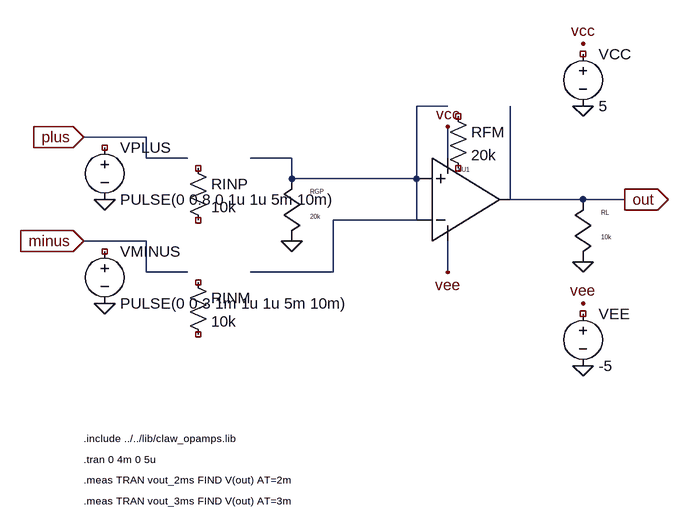
[diagram p0: schematic opamp_difference.asc]
opamp_difference.asc, the LTspice schematic file:
Version 4
SHEET 1 1200 935
WIRE 64 192 160 192
WIRE 160 192 160 224
WIRE 160 224 224 224
WIRE 320 224 384 224
WIRE 384 224 384 256
WIRE 384 256 576 256
WIRE 64 352 160 352
WIRE 160 352 160 400
WIRE 160 400 224 400
WIRE 320 400 448 400
WIRE 448 400 448 320
WIRE 448 320 576 320
WIRE 576 320 576 144
WIRE 576 144 624 144
WIRE 720 144 720 288
WIRE 720 288 896 288
WIRE 624 224 624 176
WIRE 624 352 624 400
SYMBOL voltage 96 192 R0
SYMATTR InstName VPLUS
SYMATTR Value PULSE(0 0.8 0 1u 1u 5m 10m)
SYMBOL voltage 96 352 R0
SYMATTR InstName VMINUS
SYMATTR Value PULSE(0 0.3 1m 1u 1u 5m 10m)
SYMBOL voltage 832 48 R0
SYMATTR InstName VCC
SYMATTR Value 5
SYMBOL voltage 832 448 R0
SYMATTR InstName VEE
SYMATTR Value -5
SYMBOL res 224 400 R0
SYMATTR InstName RINM
SYMATTR Value 10k
SYMBOL res 624 144 R0
SYMATTR InstName RFM
SYMATTR Value 20k
SYMBOL res 224 224 R0
SYMATTR InstName RINP
SYMATTR Value 10k
SYMBOL res_v 384 256 R0
SYMATTR InstName RGP
SYMATTR Value 20k
SYMBOL opamp2 576 224 R0
SYMATTR InstName XU1
SYMATTR Value CLAW_IDEAL_OPAMP
SYMBOL res_v 832 288 R0
SYMATTR InstName RL
SYMATTR Value 10k
FLAG 64 192 plus
IOPIN 64 192 In
FLAG 64 352 minus
IOPIN 64 352 In
FLAG 896 288 out
IOPIN 896 288 Out
FLAG 96 288 0
FLAG 96 448 0
FLAG 384 352 0
FLAG 832 384 0
FLAG 832 48 vcc
FLAG 832 144 0
FLAG 832 448 vee
FLAG 832 544 0
FLAG 624 176 vcc
FLAG 624 400 vee
TEXT 64 656 Left 1 !.include ../../lib/claw_opamps.lib
TEXT 64 688 Left 1 !.tran 0 4m 0 5u
TEXT 64 720 Left 1 !.meas TRAN vout_2ms FIND V(out) AT=2m
TEXT 64 752 Left 1 !.meas TRAN vout_3ms FIND V(out) AT=3m

The netlist it stands for:
* opamp_difference.asc
VPLUS NC_01 0 PULSE(0 0.8 0 1u 1u 5m 10m)
VMINUS NC_02 0 PULSE(0 0.3 1m 1u 1u 5m 10m)
VCC NC_03 0 5
VEE NC_04 0 -5
RINM NC_05 NC_06 10k
RFM NC_07 NC_08 20k
RINP NC_09 NC_10 10k
RGP N001 0 20k
XXU1 CLAW_IDEAL_OPAMP CLAW_IDEAL_OPAMP
RL out 0 10k
.include ../../lib/claw_opamps.lib
.tran 0 4m 0 5u
.meas TRAN vout_2ms FIND V(out) AT=2m
.meas TRAN vout_3ms FIND V(out) AT=3m
.backanno
.end